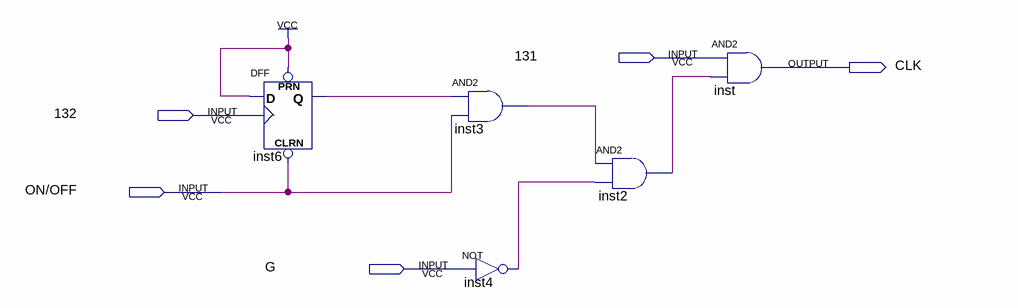
[diagram p0: schematic sheet]
// Quartus schematic Start.bdf as structural Verilog: 5 symbols, 5 pins
module Start (
  input  \131 ,
  input  \132 ,
  input  \ON/OFF ,
  input  G,
  output CLK
);

  wire inst2_out, inst3_out, inst4_out, inst6_q;

  DFF inst6 (.CLRN(\ON/OFF ), .CLK(\132 ), .D(1'b1), .PRN(1'b1), .Q(inst6_q));
  and inst3 (inst3_out, inst6_q, \ON/OFF );
  not inst4 (inst4_out, G);
  and inst2 (inst2_out, inst3_out, inst4_out);
  and inst (CLK, \131 , inst2_out);
endmodule
